# Altium project PCB_SolB.PrjPcb
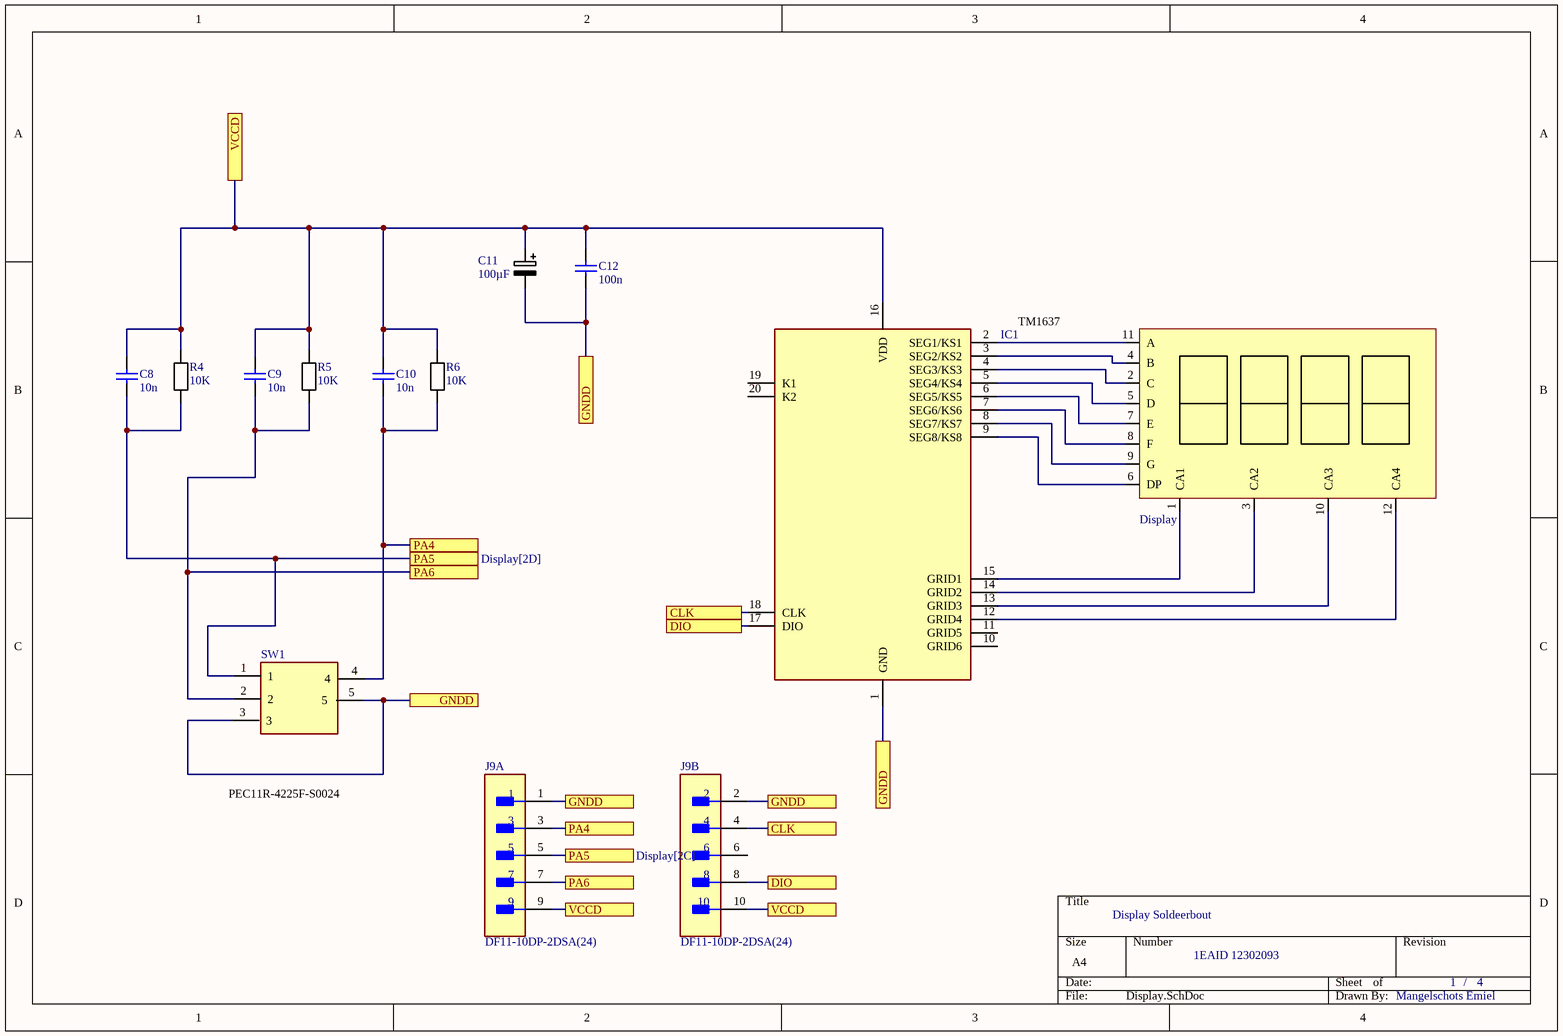
[diagram p0: Display.SchDoc]
5 sheets, 85 parts. Net scope: flat (ports and power ports of the same name join across sheets).
Board files: PCB1.PcbDoc, PCB2.PcbDoc
Sheets:
  Display.SchDoc
  SolBin.SchDoc
  SolBout.SchDoc
  VoedingBat20V.SchDoc
  CPU.SchDoc

## Sheet Display.SchDoc: Display Soldeerbout
size A4; DrawnBy: Mangelschots Emiel; SheetNumber: 1; SheetTotal: 4; Parameter 1: /; Parameter 2: 1EAID 12302093

### Parts
C8  10n  [CAPA]
C9  10n  [CAPA]
C10  10n  [CAPA]
C11  100µF  [CAPA1]
C12  100n  [CAPA]
IC8  IC1  [DIP778W43P254L2612H431Q20N]
J9  DF11-10DP-2DSA(24)  [FP-DF11-10DP-2DSA_24-MFG]  (parts A,B of 2)
KW4-801AVB  Display  [DISP]
R4  10K  [REST]
R5  10K  [REST]
R6  10K  [REST]
SW1  SW1  [SW1]  (value not drawn)

### Ports
CLK (see Display[2C]), CLK (see Display[2D]), DIO (see Display[2C]), DIO (see Display[2D]), GNDD (see Display[2B], Display[2C], Display[2D]), GNDD (see Display[2B], Display[2C], Display[2D], Display[3D]), GNDD (see Display[2B], Display[2D], Display[3D]), GNDD (see Display[2C], Display[2D], Display[3D]), PA4 (see Display[2C]), PA4 (see Display[2D]), PA5 (see Display[2C]), PA5 (see Display[2D]), PA6 (see Display[2C]), PA6 (see Display[2D]), VCCD (see Display[1A], Display[2D]), VCCD (see Display[2D])

### Nets
NetC8_1: C8.1 J9.5 R4.1 SW1.1 ; port PA5
NetC8_2: C8.2 C9.2 C10.2 C11.1 C12.2 IC8.16(VDD) J9.9 J9.10 R4.2 R5.2 R6.2 ; port VCCD
NetC9_1: C9.1 J9.7 R5.1 SW1.2 ; port PA6
NetC10_1: C10.1 J9.3 R6.1 SW1.4 ; port PA4
NetC11_2: C11.2 C12.1 IC8.1(GND) J9.1 J9.2 SW1.3 SW1.5 ; port GNDD
NetIC8_2: IC8.2(SEG1/KS1) KW4-801AVB.11(A)
NetIC8_3: IC8.3(SEG2/KS2) KW4-801AVB.4(B)
NetIC8_4: IC8.4(SEG3/KS3) KW4-801AVB.2(C)
NetIC8_5: IC8.5(SEG4/KS4) KW4-801AVB.5(D)
NetIC8_6: IC8.6(SEG5/KS5) KW4-801AVB.7(E)
NetIC8_7: IC8.7(SEG6/KS6) KW4-801AVB.8(F)
NetIC8_8: IC8.8(SEG7/KS7) KW4-801AVB.9(G)
NetIC8_9: IC8.9(SEG8/KS8) KW4-801AVB.6(DP)
NetIC8_12: IC8.12(GRID4) KW4-801AVB.12(CA4)
NetIC8_13: IC8.13(GRID3) KW4-801AVB.10(CA3)
NetIC8_14: IC8.14(GRID2) KW4-801AVB.3(CA2)
NetIC8_15: IC8.15(GRID1) KW4-801AVB.1(CA1)
NetIC8_17: IC8.17(DIO) J9.8 ; port DIO
NetIC8_18: IC8.18(CLK) J9.4 ; port CLK

Not connected (* = marked no-connect by the designer): IC8 10(GRID6) 11(GRID5) 19(K1) 20(K2); J9 6

### Notes on the sheet
- (near IC8) TM1637
- PEC11R-4225F-S0024

### Library data of the parts
C8-C10 C12 = Capasitor: Part Number: GRM1885C1H100JA01D; Manufacturer: Murata
C11 = Capasitor_1: Part Number: GRM1885C1H100JA01D; Manufacturer: Murata
IC8 = IC1: TM1637
J9 = CMP-11610-000008-1: CONN HEADER VERT 10POS 2MM; Manufacturer: Hirose; Number Of Contacts: 10; Voltage Rating: 250V; Conn Orientation: Straight; Conn Gender: Male; Current Rating: 2A; Temperature Range High: +85°C; RoHS: TRUE; Device Class L2: Headers and Wire Housings; ComponentLink2URL: https://www.hirose.com/product/document?clcode=CL0543-0520-0-24&productname=DF11-10DP-2DSA(24)&series=DF11&documenttype=Catalog&lang=en&documentid=D31688_en; Height: 6.9mm; Package: DF11-10DP-2DSA(24); ComponentLink2Description: Datasheet; Automotive: No; Digikey Description: CONN HEADER VERT 10POS 2MM; Manufacturer Part Number: DF11-10DP-2DSA(24); Temperature: -40°C to +85°C; Octopart: https://octopart.com/df11-10dp-2dsa%2824%29-hirose-39521433; Number Of Rows: 2; Device Class L3: unset; Contact Material: Tin,Nickel; Mouser Description: Headers & Wire Housings 10P STRT HEADER THRU HL,BD MNT,SN; Category: Conn; Device Class L1: Connectors; Temperature Range Low: -40°C; Pitch: 2mm; Lead Free: Yes; Footprint Url: https://www.hirose.com/product/document?clcode=CL0543-0520-0-24&productname=DF11-10DP-2DSA(24)&series=DF11&documenttype=2DDrawing&lang=en&documentid=0000995333
KW4-801AVB = Display: KW4-801AVB
R4-R6 = resistor: Manufacturer: Vishay Dale; Part Number: CRCW08050000Z0EA
SW1 = SW1: PEC11R-4225F-S0024

## Sheet SolBin.SchDoc: Soldeerbout In
size A4; DrawnBy: Mangelschots Emiel; SheetNumber: 2; SheetTotal: 5; Parameter 1: /; Parameter 2: 1EAID 12302093
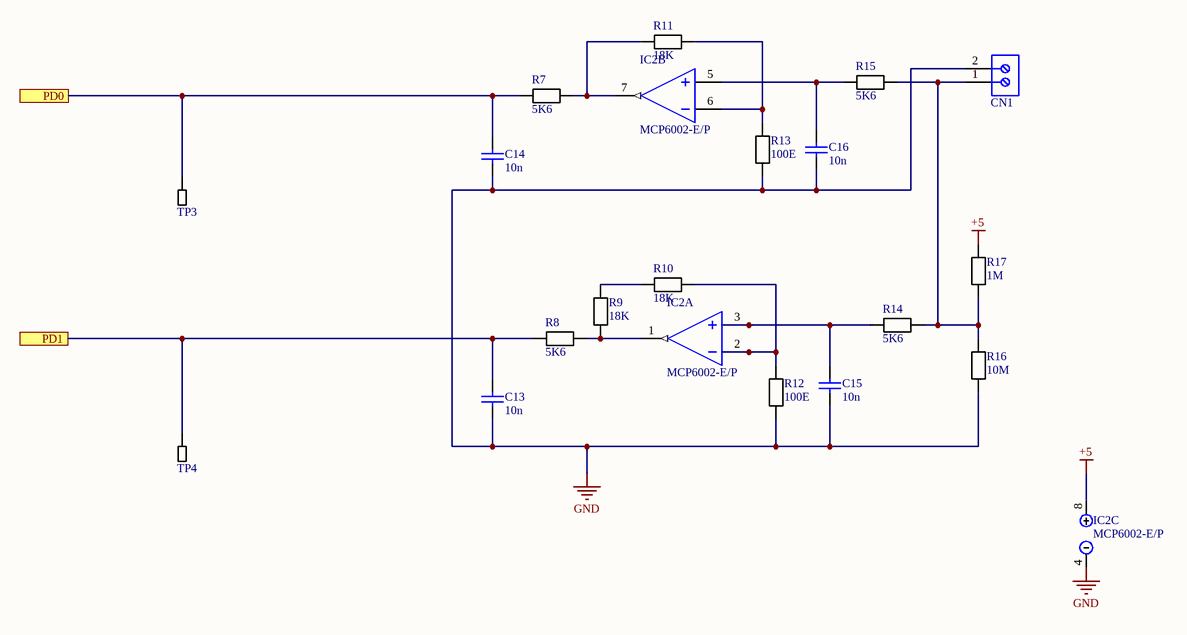
[diagram p1: SolBin.SchDoc]

### Parts
C13  10n  [CAPA]
C14  10n  [CAPA]
C15  10n  [CAPA]
C16  10n  [CAPA]
CN1  1725656  [2 pinHeader]  (value not drawn)
IC2  MCP6002-E/P  [PDIP300-P8]  (parts A,B,C of 3)
R7  5K6  [REST]
R8  5K6  [REST]
R9  18K  [REST]
R10  18K  [REST]
R11  18K  [REST]
R12  100E  [REST]
R13  100E  [REST]
R14  5K6  [REST]
R15  5K6  [REST]
R16  10M  [REST]
R17  1M  [REST]
TP3  TP  [TP]  (value not drawn)
TP4  TP  [TP]  (value not drawn)

### Ports
PD0 (see CPU[4B]), PD1 (see CPU[4B])

### Nets
+5: IC2.8 R17.2
GND: C13.1 C14.1 C15.1 C16.1 CN1.2 IC2.4 R12.1 R13.1 R16.1
NetC13_2: C13.2 R8.1 TP4.1 ; port PD1
NetC14_2: C14.2 R7.1 TP3.1 ; port PD0
NetC15_2: C15.2 IC2.3(VINA+) R14.1
NetC16_2: C16.2 IC2.5(VINB+) R15.1
NetCN1_1: CN1.1 R14.2 R15.2 R16.2 R17.1
NetIC2_1: IC2.1(VOUTA) R8.2 R9.1
NetIC2_2: IC2.2(VINA-) R10.2 R12.2
NetIC2_6: IC2.6(VINB-) R11.2 R13.2
NetIC2_7: IC2.7(VOUTB) R7.2 R11.1
NetR9_2: R9.2 R10.1

### Library data of the parts
C13-C16 = Capasitor: as C8 on sheet Display
CN1 = 2Pin-Header: Manufacturer: Phoenix Contact; Number of contacts: 2; Content: 250pc(s); Pitch: 2.54mm; Industrial packaging: Yes; Colour: Green; Manufacturer part No.: 1725656; Type: MPT0,5/2-2,54; Datasheet URL: http://datasheet.octopart.com/1725656-Phoenix-Contact-datasheet-5302866.pdf; Manufacturer URL: http://www.phoenixcontact.com/; Datasheet Version: Apr-08
IC2 = CMP-0187-00133-3: Slew Rate: 0.6V/µs; Supply Current: 100uA; Power Supply Rejection Ratio (PSRR): 86dB; Input Offset Voltage (Vos): 4.5mV; Input Bias Current: 1pA; Amplifier Type: GENERAL PURPOSE; Unity Gain Bandwidth Product: 1MHz; Number of Circuits: 2; Output Current: 23mA; Operating Supply Voltage: 5.5V; Min Supply Voltage: 1.8V; Common Mode Rejection Ratio: 60dB; Voltage Gain: 112dB; Max Supply Voltage: 6V; Package Quantity: 60; REACH SVHC: No SVHC; Min Operating Temperature: -40°C; Max Operating Temperature: 125°C; Mount: Through Hole; Nominal Supply Current: 100uA; Height: 3.3mm; Length: 9.27mm; Slew Rate-Nom: 0.6V/µs; Packaging: Rail/Tube; Output Current per Channel: 23mA; Number of Amplifiers: 2; RoHS Compliant: Yes; Radiation Hardening: No; Bandwidth: 1MHz; Lead Free: Lead Free; Width: 6.35mm; Number of Channels: 2; Gain Bandwidth Product: 1MHz; Technology: CMOS; Operating Supply Current: 100uA; Number of Elements: 2; Number of Pins: 8; Input Offset Voltage-Max: 4.5mV; Case/Package: PDIP
R7-R17 = resistor: as R4 on sheet Display
TP3 TP4 = TP: Part Number: GRM1885C1H100JA01D; Manufacturer: Murata

## Sheet SolBout.SchDoc: Soldeerbout Out
size A4; DrawnBy: Mangelschots Emiel; SheetNumber: 3; SheetTotal: 5; Parameter 1: /; Parameter 2: 1EAID 12302093
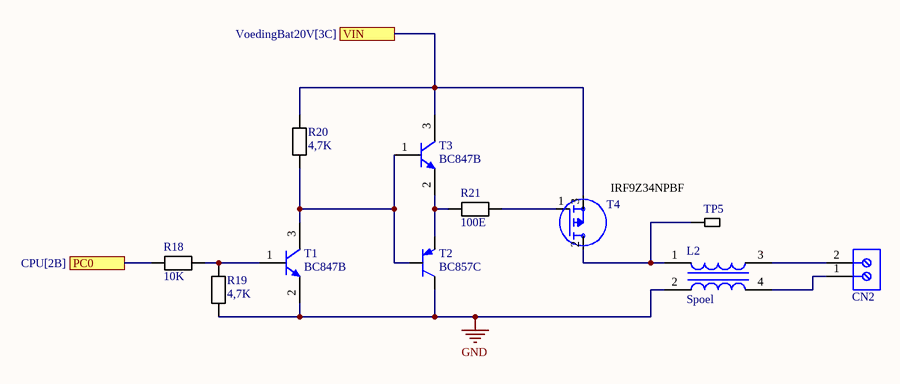
[diagram p2: SolBout.SchDoc]

### Parts
CN2  1725656  [2 pinHeader]  (value not drawn)
L2  Spoel  [Spoel]
R18  10K  [REST]
R19  4,7K  [REST]
R20  4,7K  [REST]
R21  100E  [REST]
T1  BC847B  [TRANS]
T2  BC857C  [SOT95P240X120-3N]
T3  BC847B  [TRANS]
T4  MOSFET  [TO254P1041X444X1930-3]  (value not drawn)
TP5  TP  [TP]  (value not drawn)

### Ports
PC0 (see CPU[2B]), VIN (see VoedingBat20V[3C])

### Nets
GND: L2.2 R19.1 T1.2(E) T2.3(C)
NetCN2_1: CN2.1 L2.4
NetCN2_2: CN2.2 L2.3
NetCN7_2: R20.2 T3.3(C) T4.3(S) ; port VIN
NetIC1_1: R18.1 ; port PC0
NetL2_1: L2.1 T4.2(D) TP5.1
NetR18_2: R18.2 R19.2 T1.1(B)
NetR20_1: R20.1 T1.3(C) T2.1(B) T3.1(B)
NetR21_1: R21.1 T2.2(E) T3.2(E)
NetR21_2: R21.2 T4.1(G)

### Notes on the sheet
- IRF9Z34NPBF

### Library data of the parts
CN2 = 2Pin-Header: as CN1 on sheet SolBin; Colour: Green; Manufacturer part No.: 1725656; Type: MPT0,5/2-2,54; Datasheet URL: http://datasheet.octopart.com/1725656-Phoenix-Contact-datasheet-5302866.pdf; Manufacturer URL: http://www.phoenixcontact.com/; Datasheet Version: Apr-08
L2 = Spoel: 2 Line Common Mode Choke Through Hole 170 Ohms @ 100 MHz 10A DCR 10mOhm CM2545X171B-10; MF: Laird; Value: *; Purchase-URL: https://pricing.snapeda.com/search/part/CM2545X171B-10/?ref=eda; Price: None; Package: Vertical-4 Laird; SnapEDA_Link: https://www.snapeda.com/parts/CM2545X171B-10/Laird/view-part/?ref=snap; Availability: In Stock; Check_prices: https://www.snapeda.com/parts/CM2545X171B-10/Laird/view-part/?ref=eda; MP: CM2545X171B-10
R18-R21 = resistor: as R4 on sheet Display
T1 T3 = Transistor: Manufacturer: On Semiconductor; PartNumber: BC547C; IC Continuous (A): 0.1; fT Min (MHz): 150; Packing: Bulk Box; Polarity: NPN; Mounting Technology: Through Hole; ComponentLink1URL: http://www.onsemi.com/; ComponentLink1Description: Manufacturer URL; ComponentLink3URL: http://www.onsemi.cn/pub_link/Collateral/2N6426-D.PDF; DatasheetVersion: Rev. 7; PackageVersion: Rev. AM; RoHS: FALSE; ComponentLink2URL: http://www.onsemi.com/pub_link/Collateral/BC546-D.PDF; ComponentLink3Description: Package Specification; PackageDescription: 3-Pin Transistor Outline, Body 4.825 x 3.685 mm, Pitch 1.27 mm; PackageReference: TO-92-3-29-11_AM_SL; ComponentLink2Description: Datasheet
T2 = BC857B: BJT, SOT-23, 45V, 100mA, PNP, 0.25W, 150C; MF: Diotec; SnapEDA_Link: https://www.snapeda.com/parts/BC857B/Diotec/view-part/?ref=snap; Package: SOT-23-3 Diotec; Value: *; MP: BC857B; Check_prices: https://www.snapeda.com/parts/BC857B/Diotec/view-part/?ref=eda
T4 = MOSFET: P-Channel 60V 18A _Tc_ 3.7W _Ta_, 88W _Tc_ Surface Mount D2PAK IRF9Z34SPBF; MF: Vishay; SnapEDA_Link: https://www.snapeda.com/parts/IRF9Z34SPBF/Vishay%20Siliconix/view-part/390212/?ref=snap; Price: None; MP: IRF9Z34SPBF; Value: *; Availability: Unavailable; Package: D2PAK Vishay
TP5 = TP: as TP3 on sheet SolBin

## Sheet VoedingBat20V.SchDoc: Voeding Soldeerbout
size A4; DrawnBy: Mangelschots Emiel; SheetNumber: 4; SheetTotal: 5; Parameter 1: /; Parameter 2: 1EAID 12302093
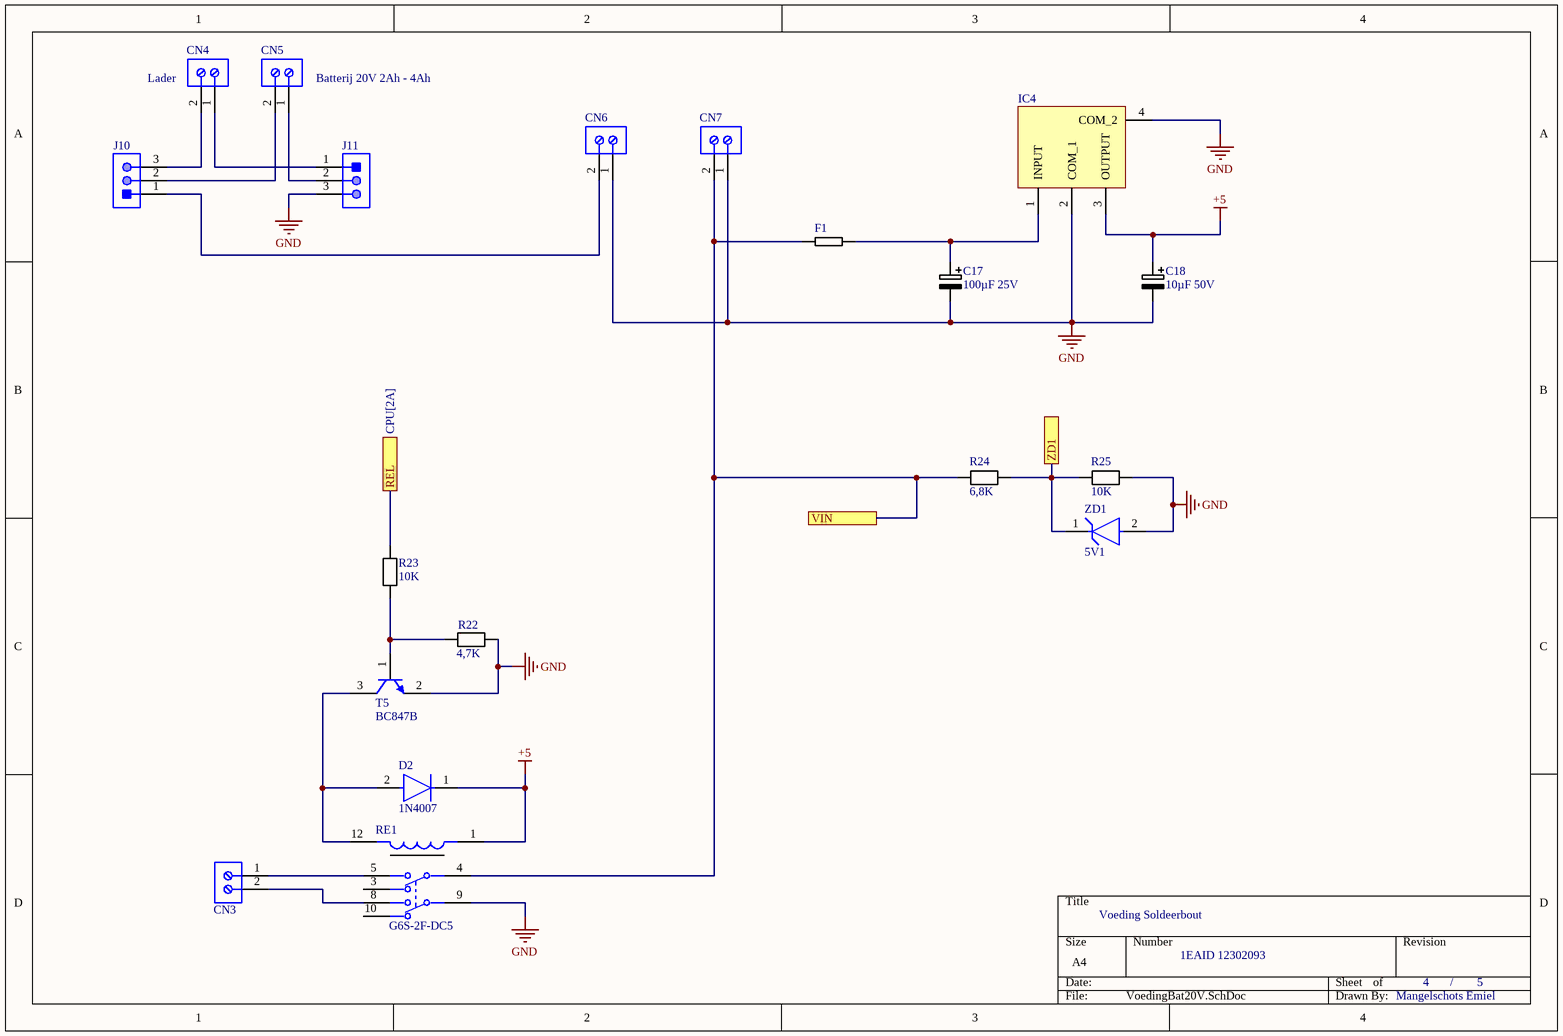
[diagram p3: VoedingBat20V.SchDoc]

### Parts
C17  100µF 25V  [CAPA1]
C18  10µF 50V  [CAPA1]
CN3  1725656  [2 pinHeader]  (value not drawn)
CN4  Lader  [2 pinHeader]
CN5  Batterij 20V 2Ah - 4Ah  [2 pinHeader]
CN6  1725656  [2 pinHeader]  (value not drawn)
CN7  1725656  [2 pinHeader]  (value not drawn)
D2  1N4007  [DIOD]
F1  F1  [F1]  (value not drawn)
IC4  OKI-78SR-5/1.5-W36-C  [SIP625W50P254L1173H771Q4]  (value not drawn)
J10  B3B-PH-K-S(LF)(SN)  [3PinH]  (value not drawn)
J11  B3B-PH-K-S(LF)(SN)  [3PinH]  (value not drawn)
K1  G6S-2F-DC5  [VermogenRelais]
R22  4,7K  [REST]
R23  10K  [REST]
R24  6,8K  [REST]
R25  10K  [REST]
RE1  SmoorSpoel  [Smoorspoel]  (value not drawn)
T5  BC847B  [TRANS]
ZD1  5V1  [ZEN]

### Ports
REL (see CPU[2A]), VIN (see SolBout[2B]), ZD1 (see CPU[4B])

### Nets
+5: C18.1 D2.1(C) IC4.3(OUTPUT) RE1.1
GND: C17.2 C18.2 CN6.1 CN7.1 IC4.2(COM_1) IC4.4(COM_2) J11.3 K1.9 R22.2 R25.2 T5.2(E) ZD1.2(A)
NetC17_1: C17.1 F1.2 IC4.1(INPUT)
NetCN3_1: CN3.1 K1.5
NetCN3_2: CN3.2 K1.8
NetCN4_1: CN4.1 J11.1
NetCN4_2: CN4.2 J10.3
NetCN5_1: CN5.1 J11.2
NetCN5_2: CN5.2 J10.2
NetCN6_2: CN6.2 J10.1
NetCN7_2: CN7.2 F1.1 K1.4 R24.1 ; port VIN
NetD2_2: D2.2(A) RE1.12 T5.3(C)
NetIC1_11: R24.2 R25.1 ZD1.1(C) ; port ZD1
NetIC1_19: R23.2 ; port REL
NetR22_1: R22.1 R23.1 T5.1(B)

Not connected (* = marked no-connect by the designer): K1 3 10

### Library data of the parts
C17 C18 = Capasitor_1: as C11 on sheet Display
CN3 CN6 CN7 = 2Pin-Header: as CN1 on sheet SolBin; Colour: Green; Manufacturer part No.: 1725656; Type: MPT0,5/2-2,54; Datasheet URL: http://datasheet.octopart.com/1725656-Phoenix-Contact-datasheet-5302866.pdf; Manufacturer URL: http://www.phoenixcontact.com/; Datasheet Version: Apr-08
CN4 CN5 = 2Pin-Header: Manufacturer part No.: 1725656; Manufacturer: Phoenix Contact; Number of contacts: 2; Content: 250pc(s); Pitch: 2.54mm; Industrial packaging: Yes; Colour: Green; Type: MPT0,5/2-2,54; Datasheet URL: http://datasheet.octopart.com/1725656-Phoenix-Contact-datasheet-5302866.pdf; Manufacturer URL: http://www.phoenixcontact.com/; Datasheet Version: Apr-08
D2 = Diode: 1N4001-E3/54; Max Surge Current: 30A; Forward Voltage: 1.1V; Average Rectified Current: 1A; Voltage: 50V; Capacitance: 15pF; Peak Non-Repetitive Surge Current: 45A; Polarity: Standard; Max Reverse Current: 5uA; Element Configuration: Single; Length: 0.204inch; Diameter: 2.7mm; Mount: Through Hole; Package Quantity: 5500; Series: -; Radiation Hardening: No; Width: 2.7mm; Max Forward Surge Current (Ifsm): 30A; Current Rating: 1A; Height: 2.7mm; Forward Current: 1A; Lead Free: Lead Free; Min Operating Temperature: -50°C; Number of Pins: 2; RoHS Compliant: Yes; Packaging: Tape and Reel; Current: 1A; Max Reverse Voltage (DC): 50V; Output Current: 1A; Reverse Voltage: 50V; Case/Package: DO-204AL; Max Repetitive Reverse Voltage (Vrrm): 50V; Voltage Rating (DC): 50V; Max Operating Temperature: 150°C
IC4 = IC: Manufacturer: Murata; Current - Output (Max): 1.5A; Power (Watts) - Max: 8W; Efficiency: 90.5%; Voltage - Input (Min): 7V; Voltage - Input (Max): 36V; Voltage - Output 1: 5V; Number of Outputs: 1; Package / Case: 3-SIPModule; Features: SCP; Type: LinearRegulatorReplacement; Size / Dimension: 0.41"Lx0.30"Wx0.65"H(10.4mmx7.6mmx16.5mm); Datasheet URL: https://datasheet.ciiva.com/8006/1790439-8006672.pdf; Datasheet Version: Oct-13; Power (Watts) - Manufacture Series: 8W; Voltage - Output 2: -; Series: Okami™OKI-78SR; Family: DCDCConverters; Manufacturer URL: http://www.murata.com/; Category: PowerSupplies-BoardMount; Voltage - Isolation: -; Packaging: Tube; Applications: ITE(Commercial); Mounting Type: ThroughHole; Voltage - Output 3: -; Operating Temperature: -40degC~85degC
J10 J11 = 3Pin-Header: Manufacturer: JST; Style/Orientation: StraightHeader/Plug; Pitch: 2mm; No of Positions: 3; Termination: Crimp; Manufacturer URL: http://www.jst.com/home2.html; Datasheet Version: Oct-06; Type: ShroudedHeader; Datasheet URL: https://datasheet.ciiva.com/11746/0900766b80826550-11746939.pdf
K1 = VermogenRelais: Manufacturer Part Number: RT424005; Manufacturer: TE Connectivity; Coil Power: 403mW; Throw Configuration: DPDT; Coil Voltage: 5V; Number Of Contacts: 2; Coil Resistance: 62Ω; Current Rating: 8A; Coil Type: Non-Latching; Category: Relay; Octopart: https://octopart.com/5-1393243-9-te+connectivity-41835766; Device Class L3: Power Relays; ComponentLink2URL: https://www.te.com/commerce/DocumentDelivery/DDEController?Action=showdoc&DocId=Data+Sheet%7FRT2%7F1014%7Fpdf%7FEnglish%7FENG_DS_RT2_1014.pdf%7F5-1393243-9; Ambient Temperature Range High: +85°C; ComponentLink2Description: Datasheet; Digikey Description: RELAY GENERAL PURPOSE DPDT 8A 5V; Package: RT424005; Automotive: No; Device Class L1: Electromechanical; Height: 15.7mm; Device Class L2: Relays; Ambient Temperature Range Low: -40°C; Mouser Description: General Purpose Relay, Rt2 Series, Power, Non Latching, Dpdt, 5 Vdc, 8 A Rohs Compliant: Yes; Lead Free: Yes; RoHS: TRUE
R22-R25 = resistor: as R4 on sheet Display
RE1 = SmoorSpoel: Surface Mount High Frequency Inductor, NLV Series, 10 H, 5%, 1008 [2520 Metric], 33 MHz, 3.5 ohm NLV25T-100J-EF; MF: TDK; Availability: In Stock; Purchase-URL: https://pricing.snapeda.com/search/part/NLV25T-100J-EF/?ref=eda; SnapEDA_Link: https://www.snapeda.com/parts/NLV25T-100J-EF/TDK/view-part/?ref=snap; MP: NLV25T-100J-EF; Price: None; Package: SMD-2 TDK; Value: *; Check_prices: https://www.snapeda.com/parts/NLV25T-100J-EF/TDK/view-part/?ref=eda
T5 = Transistor: as T1 on sheet SolBout; Mounting Technology: Through Hole; ComponentLink1URL: http://www.onsemi.com/; ComponentLink1Description: Manufacturer URL; ComponentLink3URL: http://www.onsemi.cn/pub_link/Collateral/2N6426-D.PDF; DatasheetVersion: Rev. 7; PackageVersion: Rev. AM; RoHS: FALSE; ComponentLink2URL: http://www.onsemi.com/pub_link/Collateral/BC546-D.PDF; ComponentLink3Description: Package Specification; PackageDescription: 3-Pin Transistor Outline, Body 4.825 x 3.685 mm, Pitch 1.27 mm; PackageReference: TO-92-3-29-11_AM_SL; ComponentLink2Description: Datasheet
ZD1 = Zenerdiode

## Sheet CPU.SchDoc: CPU
size A4; DrawnBy: Mangelschots Emiel; SheetNumber: 5; SheetTotal: 5; Parameter 1: /; Parameter 2: 1EAID 12302093
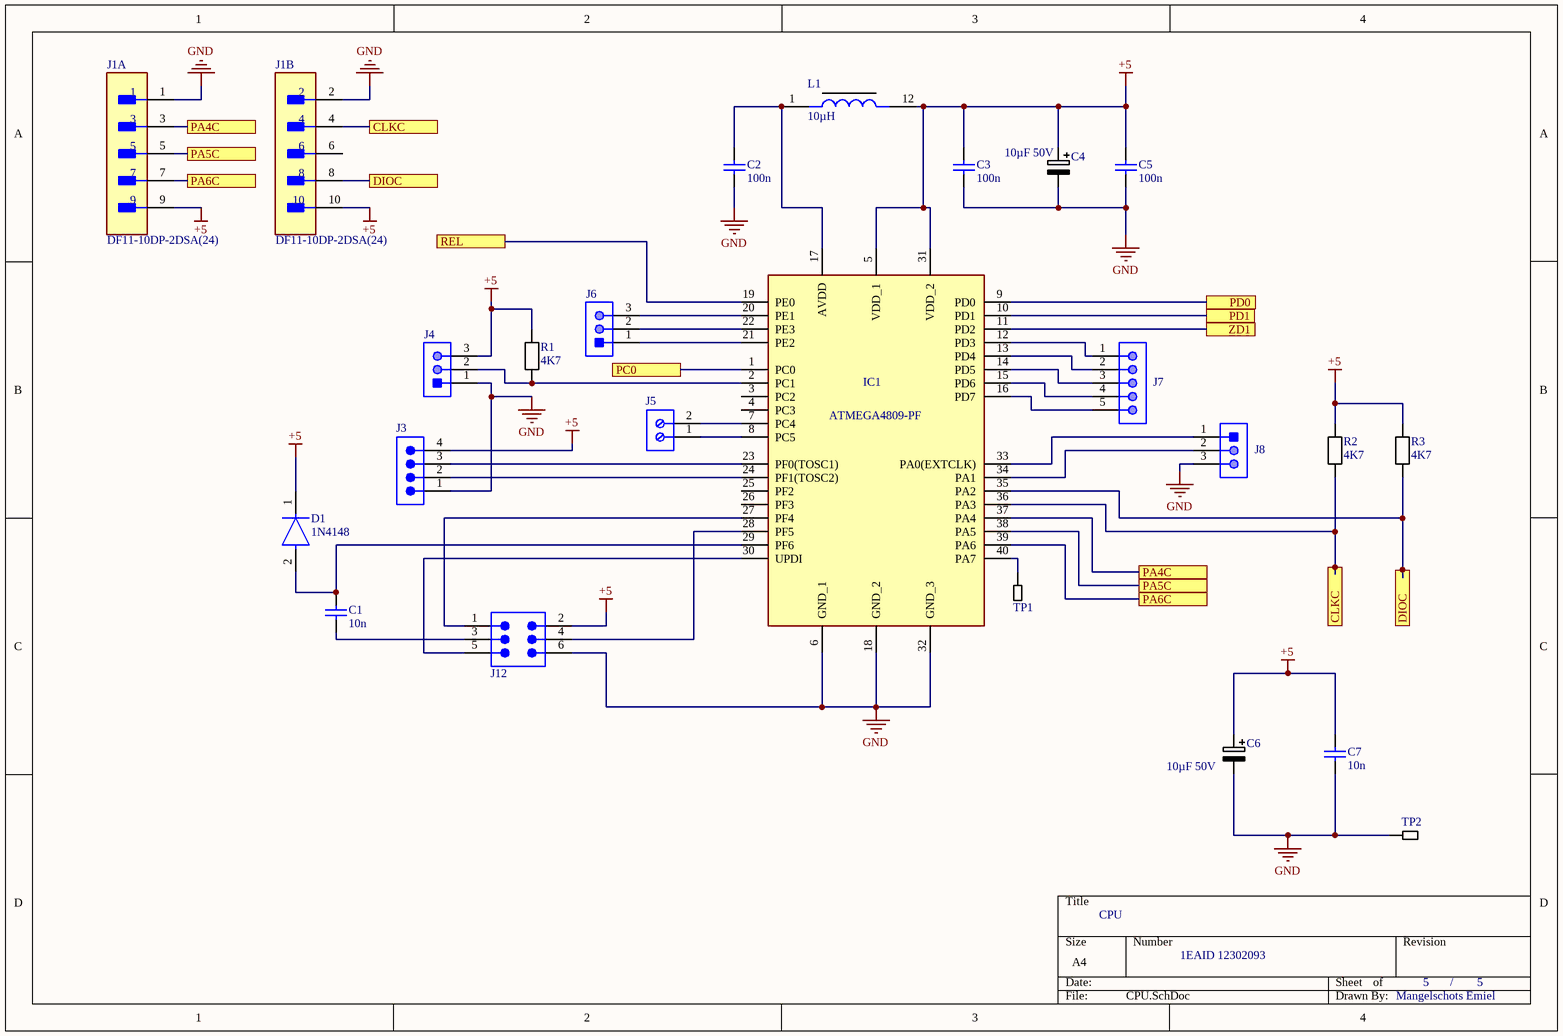
[diagram p4: CPU.SchDoc]

### Parts
C1  10n  [CAPA]
C2  100n  [CAPA]
C3  100n  [CAPA]
C4  10µF 50V  [CAPA1]
C5  100n  [CAPA]
C6  10µF 50V  [CAPA1]
C7  10n  [CAPA]
D1  1N4148  [DIOD]
IC1  ATMEGA4809-PF  [CPU]
J1  DF11-10DP-2DSA(24)  [FP-DF11-10DP-2DSA_24-MFG]  (parts A,B of 2)
J3  640456-4  [4PinH]  (value not drawn)
J4  B3B-PH-K-S(LF)(SN)  [3PinH]  (value not drawn)
J5  1725656  [2 pinHeader]  (value not drawn)
J6  B3B-PH-K-S(LF)(SN)  [3PinH]  (value not drawn)
J7  53261-0571  [5PinH]  (value not drawn)
J8  B3B-PH-K-S(LF)(SN)  [3PinH]  (value not drawn)
J12  610106249121  [6Pin-Header]  (value not drawn)
L1  10µH  [Smoorspoel]
R1  4K7  [REST]
R2  4K7  [REST]
R3  4K7  [REST]
TP1  TP  [TP]  (value not drawn)
TP2  TP  [TP]  (value not drawn)

### Ports
CLKC (see CPU[1A]), CLKC (see CPU[4C]), DIOC (see CPU[1A]), DIOC (see CPU[4C]), PA4C (see CPU[1A]), PA4C (see CPU[3C]), PA5C (see CPU[1A]), PA5C (see CPU[3C]), PA6C (see CPU[1A]), PA6C (see CPU[3C]), PC0 (see SolBout[1C]), PD0 (see SolBin[1B]), PD1 (see SolBin[1C]), REL (see VoedingBat20V[1B]), ZD1 (see VoedingBat20V[3B])

### Nets
+5: C3.2 C4.1 C5.2 C6.1 C7.2 D1.1(C) IC1.5(VDD_1) IC1.31(VDD_2) J1.9 J1.10 J3.4 J4.3 J12.2 L1.12 R1.2 R2.2 R3.2
GND: C2.1 C3.1 C4.2 C5.1 C6.2 C7.1 IC1.6(GND_1) IC1.18(GND_2) IC1.32(GND_3) J1.1 J1.2 J3.1 J4.1 J8.3 J12.6 TP2.1
NetC1_1: C1.1 J12.3
NetC1_2: C1.2 D1.2(A) IC1.29(PF6)
NetC2_2: C2.2 IC1.17(AVDD) L1.1
NetC13_2: IC1.10(PD1) ; port PD1
NetC14_2: IC1.9(PD0) ; port PD0
NetIC1_1: IC1.1(PC0) ; port PC0
NetIC1_2: IC1.2(PC1) J4.2 R1.1
NetIC1_7: IC1.7(PC4) J5.2
NetIC1_8: IC1.8(PC5) J5.1
NetIC1_11: IC1.11(PD2) ; port ZD1
NetIC1_12: IC1.12(PD3) J7.1
NetIC1_13: IC1.13(PD4) J7.2
NetIC1_14: IC1.14(PD5) J7.3
NetIC1_15: IC1.15(PD6) J7.4
NetIC1_16: IC1.16(PD7) J7.5
NetIC1_19: IC1.19(PE0) ; port REL
NetIC1_20: IC1.20(PE1) J6.3
NetIC1_21: IC1.21(PE2) J6.1
NetIC1_22: IC1.22(PE3) J6.2
NetIC1_23: IC1.23(PF0(TOSC1)) J3.3
NetIC1_24: IC1.24(PF1(TOSC2)) J3.2
NetIC1_27: IC1.27(PF4) J12.1
NetIC1_28: IC1.28(PF5) J12.4
NetIC1_30: IC1.30(UPDI) J12.5
NetIC1_33: IC1.33(PA0(EXTCLK)) J8.1
NetIC1_34: IC1.34(PA1) J8.2
NetIC1_35: IC1.35(PA2) J1.8 R3.1 ; port DIOC
NetIC1_36: IC1.36(PA3) J1.4 R2.1 ; port CLKC
NetIC1_37: IC1.37(PA4) J1.3 ; port PA4C
NetIC1_38: IC1.38(PA5) J1.5 ; port PA5C
NetIC1_39: IC1.39(PA6) J1.7 ; port PA6C
NetIC1_40: IC1.40(PA7) TP1.1

Not connected (* = marked no-connect by the designer): IC1 3(PC2) 4(PC3) 25(PF2) 26(PF3); J1 6

### Library data of the parts
C1-C3 C5 C7 = Capasitor: as C8 on sheet Display
C4 C6 = Capasitor_1: as C11 on sheet Display
D1 = Diode: as D2 on sheet VoedingBat20V; Length: 0.204inch; Diameter: 2.7mm; Mount: Through Hole; Package Quantity: 5500; Series: -; Radiation Hardening: No; Width: 2.7mm; Max Forward Surge Current (Ifsm): 30A; Current Rating: 1A; Height: 2.7mm; Forward Current: 1A; Lead Free: Lead Free; Min Operating Temperature: -50°C; Number of Pins: 2; RoHS Compliant: Yes; Packaging: Tape and Reel; Current: 1A; Max Reverse Voltage (DC): 50V; Output Current: 1A; Reverse Voltage: 50V; Case/Package: DO-204AL; Max Repetitive Reverse Voltage (Vrrm): 50V; Voltage Rating (DC): 50V; Max Operating Temperature: 150°C
IC1 = CPU: IC MCU 8BIT 48KB FLASH 40DIP ATMEGA4809-PF; RoHS Compliant: Yes
J1 = CMP-11610-000008-1: as J9 on sheet Display; Temperature Range High: +85°C; RoHS: TRUE; Device Class L2: Headers and Wire Housings; ComponentLink2URL: https://www.hirose.com/product/document?clcode=CL0543-0520-0-24&productname=DF11-10DP-2DSA(24)&series=DF11&documenttype=Catalog&lang=en&documentid=D31688_en; Height: 6.9mm; Package: DF11-10DP-2DSA(24); ComponentLink2Description: Datasheet; Automotive: No; Digikey Description: CONN HEADER VERT 10POS 2MM; Manufacturer Part Number: DF11-10DP-2DSA(24); Temperature: -40°C to +85°C; Octopart: https://octopart.com/df11-10dp-2dsa%2824%29-hirose-39521433; Number Of Rows: 2; Device Class L3: unset; Contact Material: Tin,Nickel; Mouser Description: Headers & Wire Housings 10P STRT HEADER THRU HL,BD MNT,SN; Category: Conn; Device Class L1: Connectors; Temperature Range Low: -40°C; Pitch: 2mm; Lead Free: Yes; Footprint Url: https://www.hirose.com/product/document?clcode=CL0543-0520-0-24&productname=DF11-10DP-2DSA(24)&series=DF11&documenttype=2DDrawing&lang=en&documentid=0000995333
J3 = 4Pin-Header: Manufacturer: TE Connectivity; Material, Housing: Polyester; Primary Type: InterconnectSystem; Mount Angle: Vertical; Color, Housing: White; Current, Rating: 5 / A; Agency Approvals: CSA,UL; Contact Termination Area Plating: Tin; Temperature, Operating: -55to+105 / degC; Standards: RoHSCompliant,ELVCompliant,UL94V-0; Number of Positions: 4; Brand/Series: MTA-100Series; Angle: Straight; Pin Spacing: 0.1 / "; Material, Contact: CopperAlloy; Connector Type: MTA-100; Special Features: Pinstrip; Mounting Hole Size: 0.04 / "; Contact Centerline Spacing: 0.100 / in.; Voltage, Rating: 250 / V; Manufacturer URL: http://www.te.com/; Length, Pin: 0.14 / "; Length, Overall: 0.4 / "; Color: White; Flammability Rating: UL94V-0; Mounting Type: PCMount; Termination: Solder; Datasheet URL: https://datasheet.ciiva.com/16286/eng-ds-82056-mta-0608-16286228.pdf; Number of Contacts: 4; Contact Shape: Square; Contact Mating Area Plating: Tin; Length, Terminal Post: 0.14 / in.; Size, Post: 0.025 / in.; Contact Plating: Tin; Type: PCBPlug; Datasheet Version: Dec-14; Number of Rows: 1
J4 J6 J8 = 3Pin-Header: as J10 on sheet VoedingBat20V; Termination: Crimp; Manufacturer URL: http://www.jst.com/home2.html; Datasheet Version: Oct-06; Type: ShroudedHeader; Datasheet URL: https://datasheet.ciiva.com/11746/0900766b80826550-11746939.pdf
J5 = 2Pin-Header: as CN1 on sheet SolBin; Colour: Green; Manufacturer part No.: 1725656; Type: MPT0,5/2-2,54; Datasheet URL: http://datasheet.octopart.com/1725656-Phoenix-Contact-datasheet-5302866.pdf; Manufacturer URL: http://www.phoenixcontact.com/; Datasheet Version: Apr-08
J7 = 5Pin-Header: Brand: Molex; Mounting Angle: Right; Number of Positions: 5; Voltage Rating: 125V; Current Rating: 1A; Pitch: 1.25mm; Datasheet Version: Rev. D, 04/2004; Housing Material: Thermoplastic; Series: 53261; RoHS: Details; Product Category: Headers&WireHousings; Datasheet URL: http://datasheet.octopart.com/532610571-Molex-datasheet-8343080.pdf; Manufacturer URL: http://www.molex.com/; Contact Material: PhosphorBronze; Tradename: PicoBlade; Number of Rows: 1; Product Type: Headers; Manufacturer: Molex; Type: Shrouded; Termination Style: SMD; Mounting Style: SMD/SMT; Factory Pack Quantity: 1000; Contact Plating: Tin; Packaging: Reel; Number of Positions / Contacts: 5
J12 = 6Pin-Header: CMP-1502-01146-2; NexarPartId: 52645089; Connector Type: Male Pin; Gender: Male; Contact Resistance: 20mΩ; Number of Contacts: 6; Current Rating: 3A; Pitch: 2.54mm; Operating Supply Voltage: 250V; Contact Plating: Gold; Mount: Surface Mount; RoHS: Compliant; REACH SVHC: Unknown; Packaging: Tape and Reel; Lead Pitch: 2.54mm; Termination: Solder; Color: Black; Contact Mating Length: 5.9944mm; Number of Positions: 6; Number of Rows: 2; Number of Pins: 6; Row Spacing: 2.54mm
L1 = SmoorSpoel: as RE1 on sheet VoedingBat20V; Availability: In Stock; Purchase-URL: https://pricing.snapeda.com/search/part/NLV25T-100J-EF/?ref=eda; SnapEDA_Link: https://www.snapeda.com/parts/NLV25T-100J-EF/TDK/view-part/?ref=snap; MP: NLV25T-100J-EF; Price: None; Package: SMD-2 TDK; Value: *; Check_prices: https://www.snapeda.com/parts/NLV25T-100J-EF/TDK/view-part/?ref=eda
R1-R3 = resistor: as R4 on sheet Display
TP1 TP2 = TP: as TP3 on sheet SolBin

## Nets that join several sheets
+5: SolBin (IC2.8 R17.2), VoedingBat20V (C18.1 D2.1 IC4.3 RE1.1), CPU (17 pins)
GND: SolBin (9 pins), SolBout (L2.2 R19.1 T1.2 T2.3), VoedingBat20V (12 pins), CPU (16 pins)
NetC13_2: SolBin (C13.2 R8.1 TP4.1), CPU (IC1.10)
NetC14_2: SolBin (C14.2 R7.1 TP3.1), CPU (IC1.9)
NetCN7_2: SolBout (R20.2 T3.3 T4.3), VoedingBat20V (CN7.2 F1.1 K1.4 R24.1)
NetIC1_1: SolBout (R18.1), CPU (IC1.1)
NetIC1_11: VoedingBat20V (R24.2 R25.1 ZD1.1), CPU (IC1.11)
NetIC1_19: VoedingBat20V (R23.2), CPU (IC1.19)